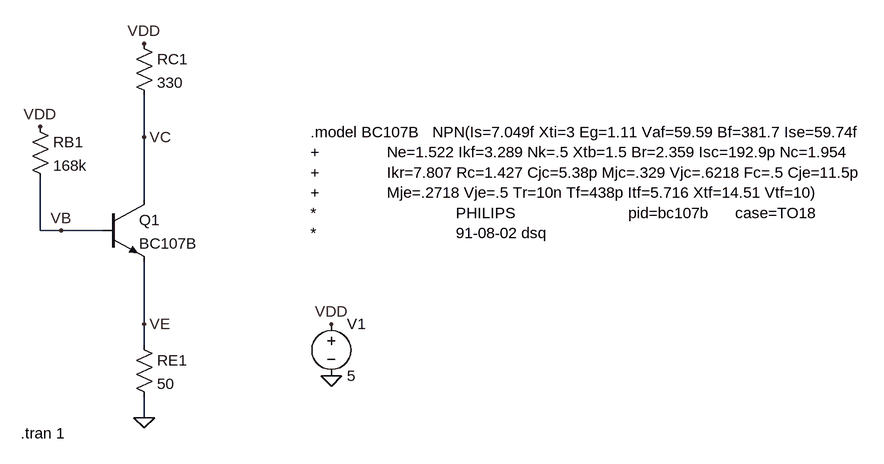
[diagram p0: schematic Draft2.asc]
Draft2.asc, the LTspice schematic file:
Version 4
SHEET 1 1464 680
WIRE 272 -48 272 -112
WIRE 272 48 272 -48
WIRE 112 96 112 16
WIRE 144 96 112 96
WIRE 208 96 144 96
WIRE 272 240 272 144
WIRE 272 272 272 240
WIRE 272 384 272 352
FLAG 272 384 0
FLAG 272 -192 VDD
FLAG 112 -64 VDD
FLAG 144 96 VB
FLAG 272 240 VE
FLAG 272 -48 VC
FLAG 560 320 0
FLAG 560 240 VDD
SYMBOL npn 208 48 R0
SYMATTR InstName Q1
SYMATTR Value BC107B
SYMBOL res 96 -80 R0
SYMATTR InstName RB1
SYMATTR Value 168k
SYMBOL res 256 -208 R0
SYMATTR InstName RC1
SYMATTR Value 330
SYMBOL res 256 256 R0
SYMATTR InstName RE1
SYMATTR Value 50
SYMBOL voltage 560 224 R0
WINDOW 123 0 0 Left 0
WINDOW 39 0 0 Left 0
SYMATTR InstName V1
SYMATTR Value 5
TEXT 528 -56 Left 2 !.model BC107B   NPN(Is=7.049f Xti=3 Eg=1.11 Vaf=59.59 Bf=381.7 Ise=59.74f\n+               Ne=1.522 Ikf=3.289 Nk=.5 Xtb=1.5 Br=2.359 Isc=192.9p Nc=1.954\n+               Ikr=7.807 Rc=1.427 Cjc=5.38p Mjc=.329 Vjc=.6218 Fc=.5 Cje=11.5p\n+               Mje=.2718 Vje=.5 Tr=10n Tf=438p Itf=5.716 Xtf=14.51 Vtf=10)\n*                               PHILIPS                         pid=bc107b      case=TO18\n*                               91-08-02 dsq
TEXT 82 408 Left 2 !.tran 1

The netlist it stands for:
* Draft2.asc
Q1 VC VB VE 0 BC107B
RB1 VDD VB 168k
RC1 VDD VC 330
RE1 VE 0 50
V1 VDD 0 5
.model NPN NPN
.model PNP PNP
.lib standard.bjt
.model BC107B   NPN(Is=7.049f Xti=3 Eg=1.11 Vaf=59.59 Bf=381.7 Ise=59.74f
+               Ne=1.522 Ikf=3.289 Nk=.5 Xtb=1.5 Br=2.359 Isc=192.9p Nc=1.954
+               Ikr=7.807 Rc=1.427 Cjc=5.38p Mjc=.329 Vjc=.6218 Fc=.5 Cje=11.5p
+               Mje=.2718 Vje=.5 Tr=10n Tf=438p Itf=5.716 Xtf=14.51 Vtf=10)
*                               PHILIPS                         pid=bc107b      case=TO18
*                               91-08-02 dsq
.tran 1
.backanno
.end

* Results of the author's LTspice run, read from the files saved beside the schematic
* Operating Point, zero values left out:
*   V(vc) = 2.589 V
*   V(vb) = 1.081 V
*   V(ve) = 366.4 mV
*   V(vdd) = 5 V
*   Ic(Q1) = 7.305 mA
*   Ib(Q1) = 23.32 µA
*   Ie(Q1) = -7.328 mA
*   I(Re1) = 7.328 mA
*   I(Rc1) = 7.305 mA
*   I(Rb1) = 23.32 µA
*   I(V1) = -7.328 mA